# EAGLE schematic FET-Driver-Modul (EAGLE 7.5.0)
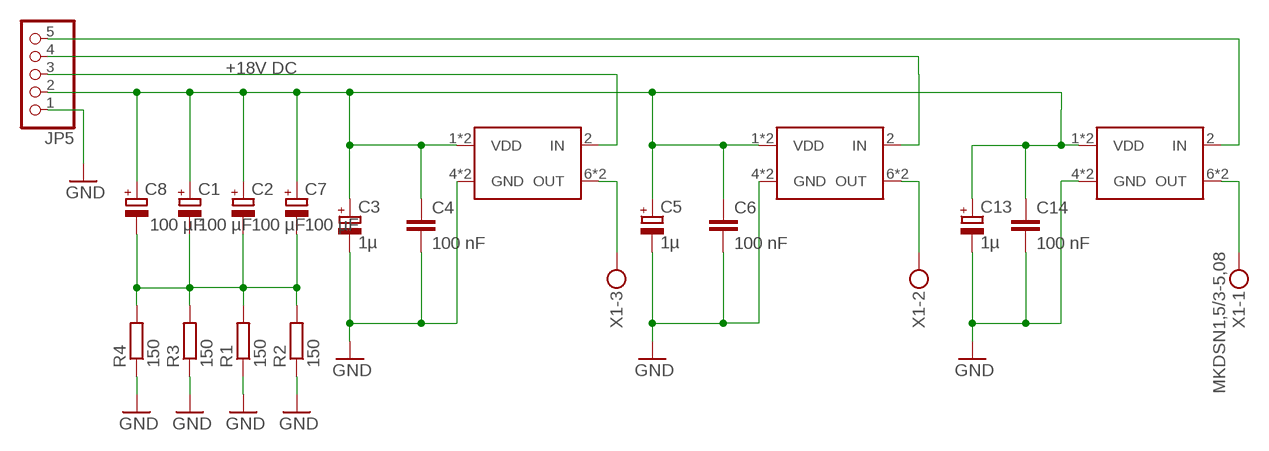
[diagram p0: schematic, sheet 1]

## Parts
C1  100 µF  CPOL-EUE2.5-7  [E2,5-7]
C2  100 µF  CPOL-EUE2.5-7  [E2,5-7]
C3  1µ  CPOL-EUE5-8.5  [E5-8,5]
C4  100 nF  C-EUC0603  [C0603]
C5  1µ  CPOL-EUE5-8.5  [E5-8,5]
C6  100 nF  C-EUC0603  [C0603]
C7  100 µF  CPOL-EUE2.5-7  [E2,5-7]
C8  100 µF  CPOL-EUE2.5-7  [E2,5-7]
C13  1µ  CPOL-EUE5-8.5  [E5-8,5]
C14  100 nF  C-EUC0603  [C0603]
JP5  PINHD-1X5  [1X05]
R1  150  R-EU_0411/15  [0411/15]
R2  150  R-EU_0411/15  [0411/15]
R3  150  R-EU_0411/15  [0411/15]
R4  150  R-EU_0411/15  [0411/15]
U$3  MCP1407MCP1407-DIL08  [DIL-08]
U$4  MCP1407MCP1407-DIL08  [DIL-08]
U$5  MCP1407MCP1407-DIL08  [DIL-08]
X1  MKDSN1,5/3-5,08  [MKDSN1,5/3-5,08]

## Nets
GND: C3.- C4.2 C5.- C6.2 C13.- C14.2 JP5.1 R1.1 R2.1 R3.1 R4.1 U$3.4(GND) U$3.5(GND) U$4.4(GND) U$4.5(GND) U$5.4(GND) U$5.5(GND)
N$1: JP5.4 U$4.2(IN)
N$2: C1.+ C2.+ C3.+ C4.1 C5.+ C6.1 C7.+ C8.+ C13.+ C14.1 JP5.2 U$3.1(VDD) U$3.8(VDD) U$4.1(VDD) U$4.8(VDD) U$5.1(VDD) U$5.8(VDD)
N$3: JP5.5 U$5.2(IN)
N$4: C1.- C2.- C7.- C8.- R1.2 R2.2 R3.2 R4.2
N$5: JP5.3 U$3.2(IN)
N$30: U$4.6(OUT) U$4.7(OUT) X1.2
N$33: U$3.6(OUT) U$3.7(OUT) X1.3
N$35: U$5.6(OUT) U$5.7(OUT) X1.1

## Notes on the sheet
- +18V DC

## Library data of the parts
C1-C3 C5 C7 C8 C13 = rcl:CPOL-EU: POLARIZED CAPACITOR, European symbol
C4 C6 C14 = resistor:C-EU: CAPACITOR, European symbol
JP5 = pinhead:PINHD-1X5: PIN HEADER
R1-R4 = resistor:R-EU_: RESISTOR, European symbol
U$3-U$5 = 0liver:MCP1407
X1 = con-phoenix-508:MKDSN1,5/3-5,08: MKDSN 1,5/ 3-5,08 Printklemme Nennstrom: 13,5 A Nennspannung: 250 V Rastermaß: 5,08 mm Polzahl: 3 Anschlussart: Schraubanschluss Montage: Löten Anschlussrichtung Leiter/Platine: 0 ° Artikelnummer: 1729131 Source: http://eshop.phoenixcontact.com .. 1729131.pdf